# EAGLE design AB - Eagle (EAGLE 6.4)
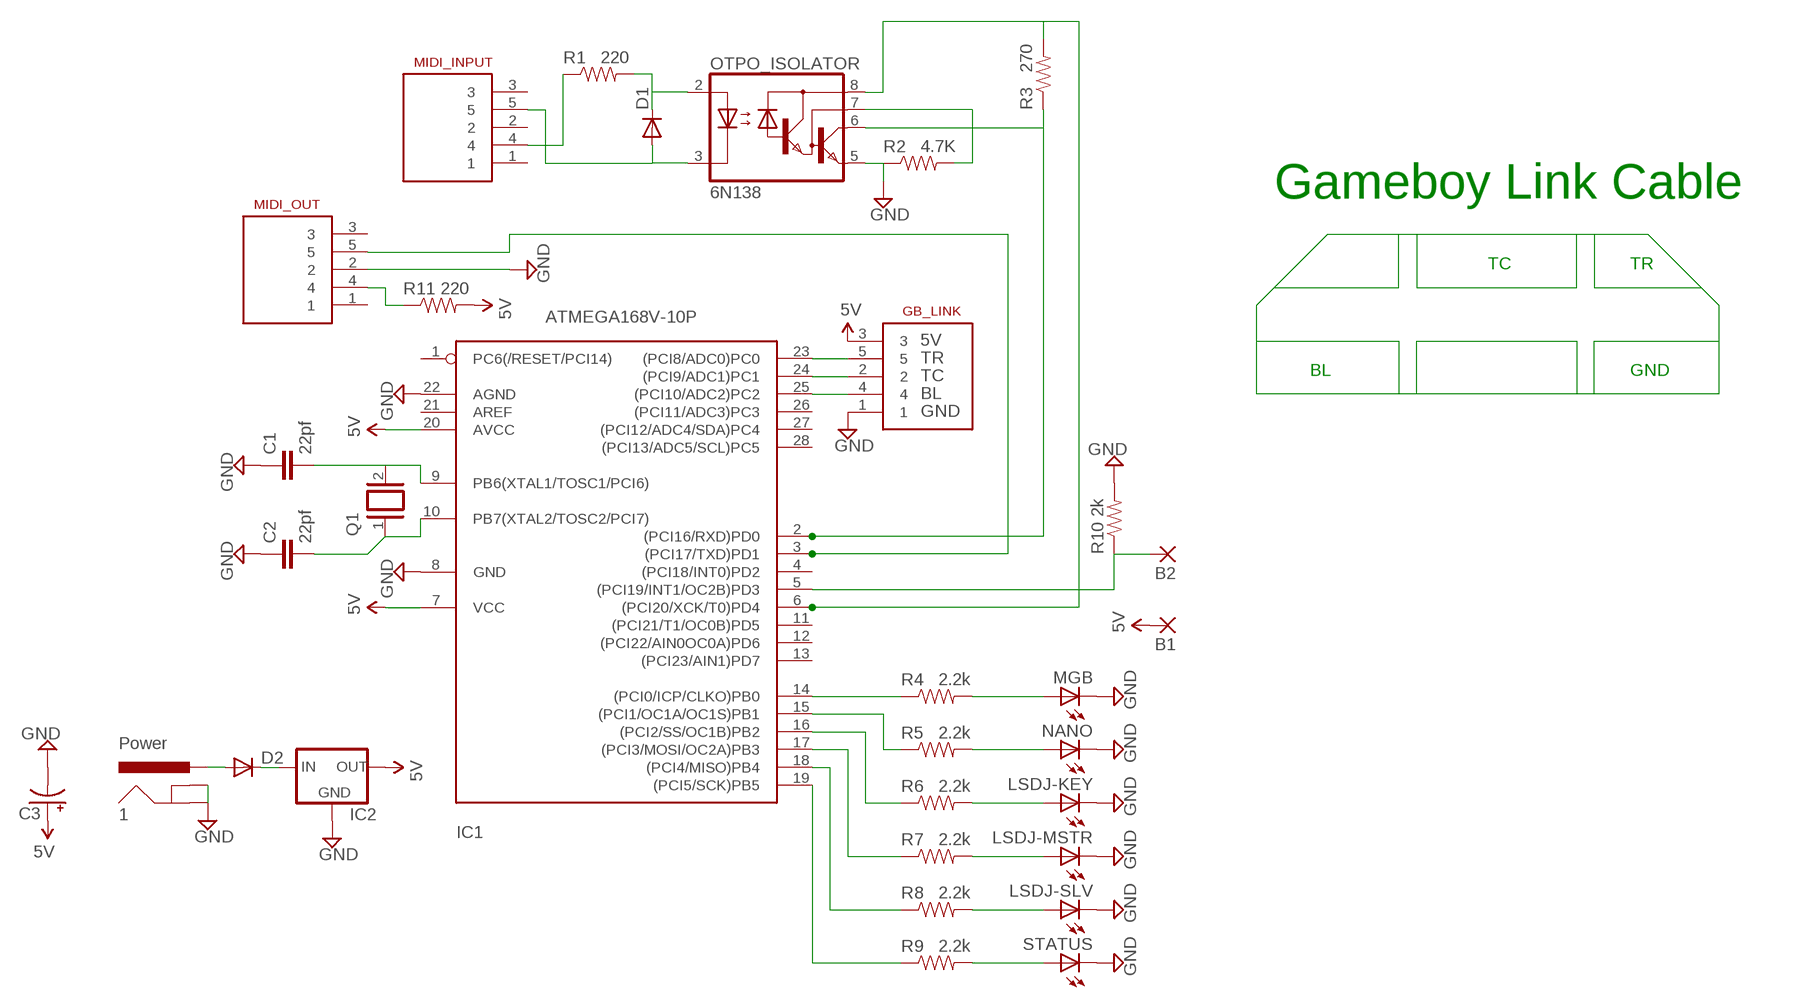
[diagram p0: schematic, sheet 1]

## Parts
1  Power  POWER_JACKPTH  [POWER_JACK_PTH]
B1  2,15/1,0  [2,15/1,0]
B2  2,15/1,0  [2,15/1,0]
C1  22pf  CAPPTH2  [CAP-PTH-SMALL2]
C2  22pf  CAPPTH2  [CAP-PTH-SMALL2]
C3  CAP_POLPTH2  [CPOL-RADIAL-10UF-25V]
D1  DIODE1N4148  [DIODE-1N4148]
D2  DIODE1N4148  [DIODE-1N4148]
GB_LINK  MIDI_CONN_FEMALE_SUPPORT  [DIN_5_FEMALE_SUPPORT]
IC1  ATMEGA168V-10P  [DIL28-3]
IC2  V_REG_78XX-TO-220  [TO-220-ALT]
LSDJ-KEY  LED3MM  [LED3MM]
LSDJ-MSTR  LED3MM  [LED3MM]
LSDJ-SLV  LED3MM  [LED3MM]
MGB  LED3MM  [LED3MM]
MIDI_INPUT  MIDI_CONN_FEMALE_SUPPORT  [DIN_5_FEMALE_SUPPORT]
MIDI_OUT  MIDI_CONN_FEMALE_SUPPORT  [DIN_5_FEMALE_SUPPORT]
NANO  LED3MM  [LED3MM]
OTPO_ISOLATOR  6N138  [DIL08]
Q1  XTAL/S  [QS]
R1  220  RESISTORAXIAL-0.3  [AXIAL-0.3]
R2  4.7K  RESISTORAXIAL-0.3  [AXIAL-0.3]
R3  270  RESISTORAXIAL-0.3  [AXIAL-0.3]
R4  2.2k  RESISTORAXIAL-0.3  [AXIAL-0.3]
R5  2.2k  RESISTORAXIAL-0.3  [AXIAL-0.3]
R6  2.2k  RESISTORAXIAL-0.3  [AXIAL-0.3]
R7  2.2k  RESISTORAXIAL-0.3  [AXIAL-0.3]
R8  2.2k  RESISTORAXIAL-0.3  [AXIAL-0.3]
R9  2.2k  RESISTORAXIAL-0.3  [AXIAL-0.3]
R10  2k  RESISTORAXIAL-0.3  [AXIAL-0.3]
R11  220  RESISTORAXIAL-0.3  [AXIAL-0.3]
STATUS  LED3MM  [LED3MM]

## Nets
5V: B1.1(P) C3.1(+) GB_LINK.3 IC1.7(VCC) IC1.20(AVCC) IC2.OUT R11.P$2
GND: 1.GND 1.GNDBREAK C1.1 C2.1 C3.2(-) GB_LINK.1 IC1.8(GND) IC1.22(AGND) IC2.GND LSDJ-KEY.K(C) LSDJ-MSTR.K(C) LSDJ-SLV.K(C) MGB.K(C) MIDI_OUT.2 NANO.K(C) OTPO_ISOLATOR.5(GND) R2.P$1 R10.P$2 STATUS.K(C)
N$1: D1.C OTPO_ISOLATOR.2(A) R1.P$2
N$2: IC1.14((PCI0/ICP/CLKO)PB0) R4.P$1
N$3: GB_LINK.5 IC1.23((PCI8/ADC0)PC0)
N$4: B2.1(P) IC1.5((PCI19/INT1/OC2B)PD3) R10.P$1
N$5: IC1.15((PCI1/OC1A/OC1S)PB1) R5.P$1
N$6: IC1.16((PCI2/SS/OC1B)PB2) R6.P$1
N$7: IC1.17((PCI3/MOSI/OC2A)PB3) R7.P$1
N$8: IC1.18((PCI4/MISO)PB4) R8.P$1
N$9: OTPO_ISOLATOR.7(VB) R2.P$2
N$10: IC1.19((PCI5/SCK)PB5) R9.P$1
N$11: IC1.2((PCI16/RXD)PD0) OTPO_ISOLATOR.6(VO) R3.P$1
N$12: MGB.A R4.P$2
N$13: NANO.A R5.P$2
N$14: LSDJ-KEY.A R6.P$2
N$15: LSDJ-MSTR.A R7.P$2
N$16: LSDJ-SLV.A R8.P$2
N$17: R9.P$2 STATUS.A
N$18: C2.2 IC1.10(PB7(XTAL2/TOSC2/PCI7)) Q1.1
N$19: C1.2 IC1.9(PB6(XTAL1/TOSC1/PCI6)) Q1.2
N$20: GB_LINK.2 IC1.24((PCI9/ADC1)PC1)
N$21: GB_LINK.4 IC1.25((PCI10/ADC2)PC2)
N$22: 1.PWR D2.A
N$23: D2.C IC2.IN
N$24: MIDI_INPUT.4 R1.P$1
N$25: D1.A MIDI_INPUT.5 OTPO_ISOLATOR.3(C)
N$27: MIDI_OUT.4 R11.P$1
N$29: IC1.6((PCI20/XCK/T0)PD4) OTPO_ISOLATOR.8(VCC) R3.P$2
TXOUT: IC1.3((PCI17/TXD)PD1) MIDI_OUT.5
Unconnected: IC1.1(PC6(/RESET/PCI14)) IC1.4((PCI18/INT0)PD2) IC1.11((PCI21/T1/OC0B)PD5) IC1.12((PCI22/AIN0OC0A)PD6) IC1.13((PCI23/AIN1)PD7) IC1.21(AREF) IC1.26((PCI11/ADC3)PC3) IC1.27((PCI12/ADC4/SDA)PC4) IC1.28((PCI13/ADC5/SCL)PC5) MIDI_INPUT.1 MIDI_INPUT.2 MIDI_INPUT.3 MIDI_OUT.1 MIDI_OUT.3

## Notes on the sheet
- Gameboy Link Cable
- TC | TR
- 5V
- TR
- BL | GND
- TC
- BL
- GND

## Library data of the parts
1 = SparkFun-Connectors:POWER_JACK: Power Jack This is the standard 5.5mm barrel jack for power. The PTH is the most common, proven, reliable, footprint. The Slot footprint only works if the mill layer is transmitted to the PCB fab house so be warned. Spark Fun Electronics SKU : PRT-00119 SMT: CONN-08106 Mating wall wart : TOL-00298 (and others)
B1 B2 = wirepad:2,15/1,0: THROUGH-HOLE PAD
C1 C2 = SparkFun-Capacitors:CAP: Capacitor Standard 0603 ceramic capacitor, and 0.1" leaded capacitor.
C3 = SparkFun-Capacitors:CAP_POL: Capacitor Polarized These are standard SMD and PTH capacitors. Normally 10uF, 47uF, and 100uF in electrolytic and tantalum varieties. Always verify the external diameter of the through hole cap, it varies with capacity, voltage, and manufacturer. The EIA devices should be standard.
D1 D2 = SparkFun-DiscreteSemi:DIODE: Diode These are standard reverse protection diodes and small signal diodes. SMA package can handle up to about 1A. SOD-323 can handle about 200mA. What the SOD-323 package when ordering, there are some mfgs out there that are 5-pin packages.
GB_LINK MIDI_INPUT MIDI_OUT = SparkFun-Connectors:MIDI_CONN_FEMALE_SUPPORT: MIDI connector with strain relief (DIN-5 female)
IC1 = adafruit:ATMEGA168*P: MICROCONTROLLER 16 kBytes FLASH 1 kBytes SRAM 512 Bytes EEPROM USART 8-channel 10 bit ADC
IC2 = SparkFun-PowerIC:V_REG_78XX: Voltage Regulator Standard 7805 5V regulator. IGO (Input Ground Output). Spark Fun Electronics SKU : COM-00107
LSDJ-KEY LSDJ-MSTR LSDJ-SLV MGB NANO STATUS = SparkFun-LED:LED: LEDs Standard schematic elements and footprints for 5mm, 3mm, 1206, and 0603 sized LEDs. 5mm - Spark Fun Electronics SKU : COM-00529 (and others)
OTPO_ISOLATOR = optocoupler:6N138: MOTOROLA OPTO COUPLER; MF: VISHAY/TELEFUNKEN; MPN: 6N138; OC_FARNELL: 9860150; OC_NEWARK: 35K5294
Q1 = special:XTAL/S: CRYSTAL
R1-R11 = SparkFun-Passives:RESISTOR: Resistor Basic schematic elements and footprints for 0603, 1206, and PTH resistors.

## Board
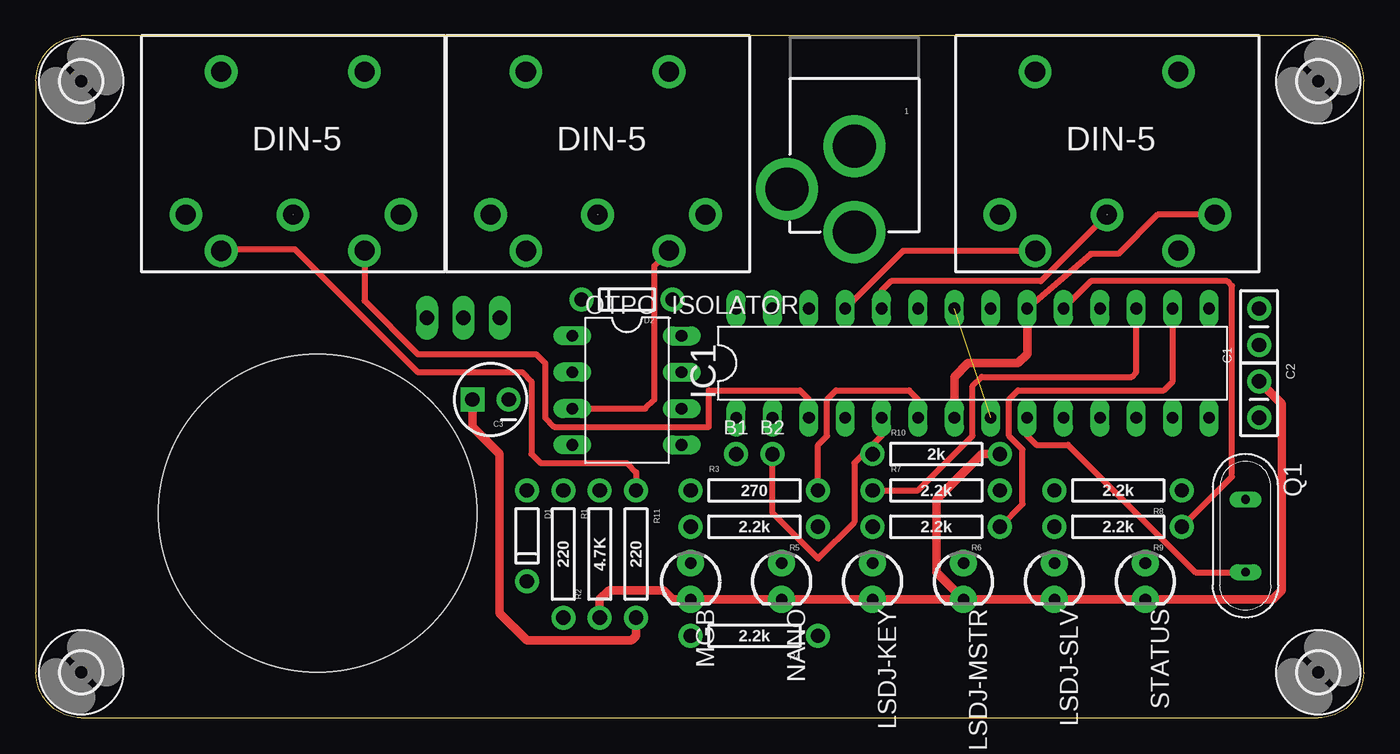
[diagram p1: board, top side]
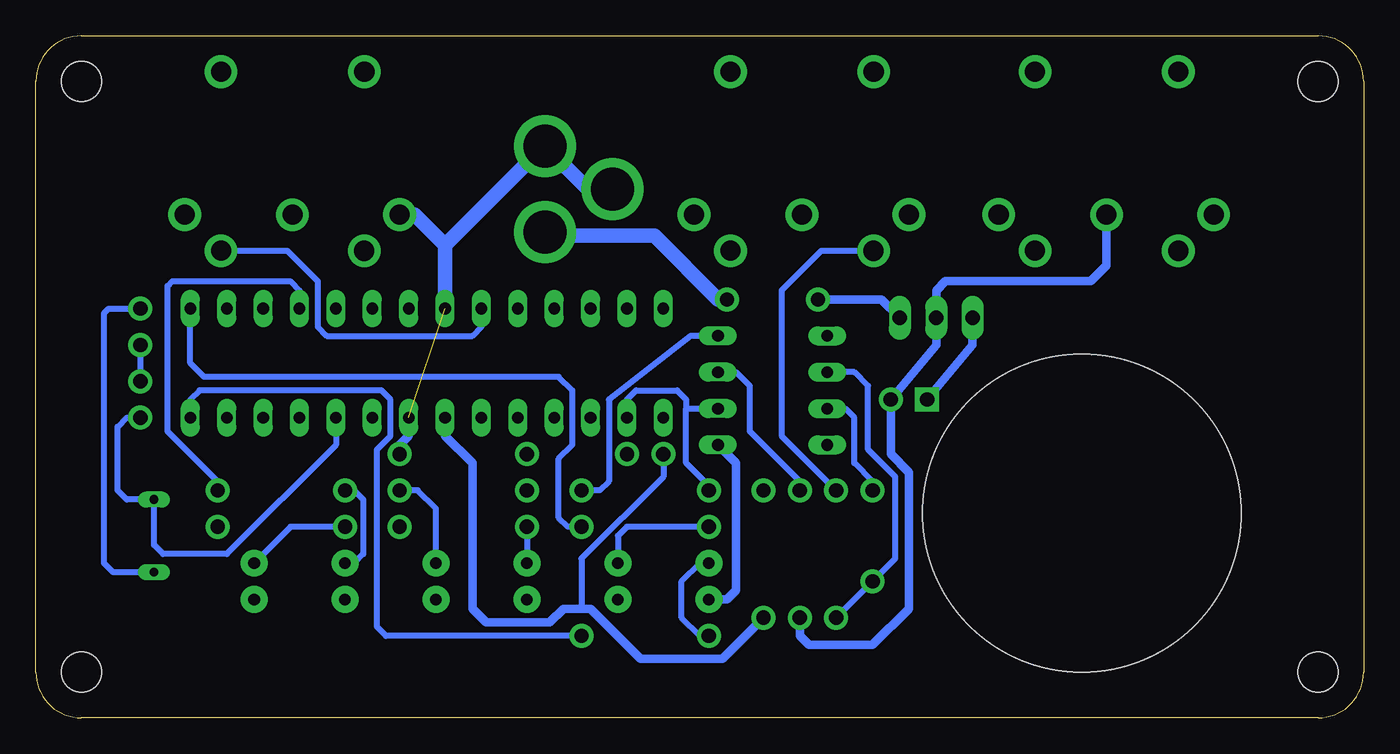
[diagram p2: board, bottom side, seen from below]

Size 92.71 x 47.62 mm. Coordinates in mm from the lower left corner, seen from the top.
Outline: 3.17,0 arc-90 0,3.17 0,44.45 arc-90 3.17,47.62 89.53,47.62 arc-90 92.71,44.45 92.71,3.17 arc-90 89.53,0 3.17,0
Copper layers (1*16): Top 0.035mm / dielectric 1.5mm / Bottom 0.035mm
Design rules "default": minimum track width 10mil, minimum drill 24mil, track to track 8mil, track to pad 8mil, pad to pad 8mil, via to via 8mil, smd to smd 8mil, copper to edge 40mil, drill to drill 8mil, minimum pad ring 10mil, minimum via ring 8mil, stop-mask expansion 4mil, vias tented up to drill 0mil, thermal gap 10mil
Holes 22.23 mm at 19.68,14.29

### Footprints (pad centres in the part's own frame; a part is rotated, then mirrored left to right if it is on the bottom)
POWER_JACK_PTH = drill 2.997 pad 4.318: GND 0,7.7; GNDBREAK 4.7,10.7; PWR 0,13.7
2,15/1,0 = drill 1 pad 1.676: 1 0,0
CAP-PTH-SMALL2 = drill 1 pad 1.676: 1 0,0; 2 2.54,0
CPOL-RADIAL-10UF-25V = drill 1 pad 1.676 square: 1 1.27,0 | drill 1 pad 1.676: 2 -1.27,0
DIODE-1N4148 = drill 1 pad 1.676: A -3.81,0; C 2.54,0
DIN_5_FEMALE_SUPPORT = drill 1.4 pad 2.286: 1 7.94,3.6; 2 0.46,3.61; 3 -7.07,3.6; 4 5.47,6.13; 5 -4.53,6.12; 6 -4.53,-6.382; 7 5.478,-6.382
DIL28-3 = drill 0.813 long: 1 -16.51,-3.81; 2 -13.97,-3.81; 3 -11.43,-3.81; 4 -8.89,-3.81; 5 -6.35,-3.81; 6 -3.81,-3.81; 7 -1.27,-3.81; 8 1.27,-3.81; 9 3.81,-3.81; 10 6.35,-3.81; 11 8.89,-3.81; 12 11.43,-3.81; 13 13.97,-3.81; 14 16.51,-3.81; 15 16.51,3.81; 16 13.97,3.81; 17 11.43,3.81; 18 8.89,3.81; 19 6.35,3.81; 20 3.81,3.81; 21 1.27,3.81; 22 -1.27,3.81; 23 -3.81,3.81; 24 -6.35,3.81; 25 -8.89,3.81; 26 -11.43,3.81; 27 -13.97,3.81; 28 -16.51,3.81
TO-220-ALT = drill 1.016 long: GND 0,0; IN -2.54,0; OUT 2.54,0
LED3MM = drill 0.813 pad 1.88: A -1.27,0; K 1.27,0
DIL08 = drill 0.813 long: 1 -3.81,-3.81; 2 -1.27,-3.81; 3 1.27,-3.81; 4 3.81,-3.81; 5 3.81,3.81; 6 1.27,3.81; 7 -1.27,3.81; 8 -3.81,3.81
QS = drill 0.61 long: 1 -2.54,0; 2 2.54,0
AXIAL-0.3 = drill 1 pad 1.676: P$1 -4.445,0; P$2 4.445,0
2,8 = hole 2.8: 0,0

### Placement (x,y rotation side)
1  57.15,47.62 180 top
B1  48.9,18.41 0 top
B2  51.44,18.41 0 top
C1  85.41,26.04 90 top
C2  85.41,23.5 270 top
C3  31.75,22.23 180 top
D1  34.29,12.06 270 top
D2  40.64,29.21 180 top
GB_LINK  75.25,38.73 180 top
IC1  65.41,24.77 0 top
IC2  29.84,27.94 180 top
LSDJ-KEY  58.42,9.53 270 top
LSDJ-MSTR  64.77,9.53 270 top
LSDJ-SLV  71.12,9.53 270 top
MGB  45.72,9.53 270 top
MIDI_INPUT  39.69,38.73 180 top
MIDI_OUT  18.41,38.73 180 top
NANO  52.07,9.53 270 top
OTPO_ISOLATOR  41.27,22.86 270 top
Q1  84.45,12.7 270 top
R1  36.83,11.43 270 top
R2  39.37,11.43 90 top
R3  50.16,15.88 0 top
R4  50.16,5.71 180 top
R5  50.16,13.34 180 top
R6  62.87,13.34 180 top
R7  62.87,15.88 0 top
R8  75.56,15.88 180 top
R9  75.56,13.34 180 top
R10  62.87,18.41 0 top
R11  41.91,11.43 270 top
STATUS  77.47,9.53 270 top
U$2  [2,8]  89.53,44.45 0 top
U$3  [2,8]  89.53,3.17 0 top
U$4  [2,8]  3.17,3.17 0 top
U$5  [2,8]  3.17,44.45 0 top

### Tracks (layer width: path | path; a pad name or v marks a point on that pad's centre or on a via)
5V
  Top 0.406: GB_LINK.3 78.31,35.13 75.56,32.38 73.66,32.38 IC1.20
  Top 0.61: IC1.7 64.14,23.81 65.09,24.77 68.58,24.77 69.22,25.4 IC1.20 | C3.1 30.48,20.32 32.38,18.41 32.38,7.3 34.29,5.4 41.59,5.4 41.91,5.71 R11.P$2
  Bottom 0.406: B1.1 48.9,16.83 54.61,11.11 54.61,7.62
  Bottom 0.61: R11.P$2 44.77,4.13 50.48,4.13 53.98,7.62 54.61,7.62 55.88,7.62 56.83,6.67 61.28,6.67 62.23,7.62 62.23,17.78 64.14,19.68 IC1.7 | C3.1 27.3,26.04 IC2.OUT
GND  (1 unrouted)
  Top 0.61: LSDJ-MSTR.K LSDJ-KEY.K NANO.K MGB.K 44.45,8.26 43.81,8.89 40.01,8.89 39.37,8.26 R2.P$1 | LSDJ-MSTR.K LSDJ-SLV.K STATUS.K 86.36,8.26 87,8.89 87,21.91 C2.1 | R10.P$2 66.04,18.41 62.87,15.24 62.87,10.16 LSDJ-MSTR.K
  Bottom 0.406: C1.1 C2.1 | 1.GND 57.23,39.92 | 54.15,36.92 1.GNDBREAK
  Bottom 0.61: R10.P$2 67.31,19.05 66.67,19.68 IC1.8 | OTPO_ISOLATOR.5 43.81,17.78 43.81,8.89 44.45,8.26 MGB.K | R2.P$1 39.37,5.71 38.73,5.08 34.29,5.08 31.75,7.62 31.75,17.14 33.02,18.41 C3.2 29.84,26.04 IC2.GND 29.84,29.84 29.21,30.48 19.05,30.48 17.95,31.57 MIDI_OUT.2
  Bottom 1.016: GB_LINK.1 66.25,35.13 64.14,33.02 | 64.14,33.02 IC1.22 | 57.23,39.92 64.14,33.02 | 54.15,36.92 1.GND
N$1
  Bottom 0.406: OTPO_ISOLATOR.2 35.56,24.13 34.61,23.18 34.61,18.73 32.7,16.83 32.7,11.11 D1.C R1.P$2
N$2
  Bottom 0.406: R4.P$1 68.26,5.71 68.9,6.35 68.9,18.73 67.94,19.68 67.94,22.23 68.58,22.86 81.28,22.86 81.92,22.23 IC1.14
N$3
  Bottom 0.406: GB_LINK.5 75.16,32.62 73.03,30.48 73.03,27.3 72.39,26.67 62.23,26.67 61.59,27.3 IC1.23
N$4
  Top 0.406: IC1.5 59.05,19.68 58.42,19.05 R10.P$1 57.78,18.41 57.15,17.78 57.15,13.65 54.61,11.11 51.44,14.29 B2.1
N$5
  Bottom 0.406: R5.P$1 55.56,13.34 56.2,13.97 56.2,18.1 55.24,19.05 55.24,22.86 56.2,23.81 80.96,23.81 81.92,24.77 IC1.15
N$6
  Top 0.406: R6.P$1 68.9,14.92 68.9,18.73 67.94,19.68 67.94,22.23 68.58,22.86 78.74,22.86 79.38,23.5 IC1.16
N$7
  Top 0.406: R7.P$1 61.59,15.88 65.41,19.68 65.41,23.18 66.04,23.81 76.52,23.81 76.83,24.13 IC1.17
N$8
  Bottom 0.406: R8.P$1 80.01,16.51 83.5,20 83.5,30.16 83.19,30.48 74.93,30.48 74.3,29.84 IC1.18
N$9
  Bottom 0.406: R2.P$2 39.37,16.51 42.86,20 42.86,23.18 43.81,24.13 OTPO_ISOLATOR.7
N$10
  Top 0.406: R9.P$1 83.5,16.83 83.5,30.16 83.19,30.48 73.66,30.48 IC1.19
N$11
  Bottom 0.406: IC1.2 51.44,22.23 50.8,22.86 47.94,22.86 47.31,22.23 47.31,21.59 | R3.P$1 45.72,16.19 47.31,17.78 47.31,21.59 | 47.31,21.59 OTPO_ISOLATOR.6
N$12
  Bottom 0.406: R4.P$2 46.35,5.71 47.62,6.99 47.62,9.53 46.35,10.79 MGB.A
N$13
  Bottom 0.406: R5.P$2 51.44,13.34 52.07,12.7 NANO.A
N$14
  Bottom 0.406: R6.P$2 LSDJ-KEY.A
N$15
  Bottom 0.406: LSDJ-MSTR.A 64.77,14.61 66.04,15.88 R7.P$2
N$16
  Bottom 0.406: R8.P$2 70.48,15.88 69.85,15.24 69.85,11.43 70.48,10.79 LSDJ-SLV.A
N$17
  Bottom 0.406: R9.P$2 74.93,13.34 STATUS.A
N$18
  Bottom 0.406: C2.2 86.36,20.95 87,20.32 87,15.88 86.36,15.24 Q1.1 84.45,12.06 83.82,11.43 79.38,11.43 71.75,19.05 IC1.10
N$19
  Top 0.406: IC1.9 69.22,19.68 69.85,19.05 72.07,19.05 80.96,10.16 Q1.2
  Bottom 0.406: Q1.2 87.31,10.16 87.95,10.79 87.95,28.26 87.63,28.57 C1.2
N$20
  Top 0.406: GB_LINK.2 74.79,35.1 70.17,30.48 59.69,30.48 59.05,29.84 IC1.24
N$21
  Top 0.406: GB_LINK.4 60.55,32.6 IC1.25
N$22
  Bottom 1.016: D2.A 45.09,29.21 49.53,33.66 56.88,33.66 1.PWR
N$23
  Bottom 0.61: D2.C 33.66,29.21 IC2.IN
N$24
  Bottom 0.406: MIDI_INPUT.4 37.88,32.6 40.64,29.84 40.64,19.68 R1.P$1
N$25
  Top 0.406: OTPO_ISOLATOR.3 42.55,21.59 43.18,22.23 43.18,31.58 MIDI_INPUT.5
  Bottom 0.406: D1.A 34.29,16.51 35.56,17.78 35.56,20.95 36.2,21.59 OTPO_ISOLATOR.3
N$27
  Top 0.406: R11.P$1 41.91,17.14 41.27,17.78 35.24,17.78 34.61,18.41 34.61,23.5 33.97,24.13 26.67,24.13 18.1,32.7 13.04,32.7 MIDI_OUT.4
N$29
  Top 0.406: R3.P$2 54.61,19.05 55.24,19.68 55.24,22.23 55.88,22.86 60.96,22.86 61.59,22.23 IC1.6
  Bottom 0.406: OTPO_ISOLATOR.8 46.99,26.67 52.7,22.23 52.7,16.51 53.34,15.88 R3.P$2
TXOUT
  Top 0.406: IC1.3 53.98,22.23 53.34,22.86 46.99,22.86 46.99,20.32 36.2,20.32 35.56,20.95 35.56,24.77 34.92,25.4 26.67,25.4 22.95,29.12 MIDI_OUT.5